# EAGLE design Grove - Infrared Emitter v1.1 (EAGLE 6.1)
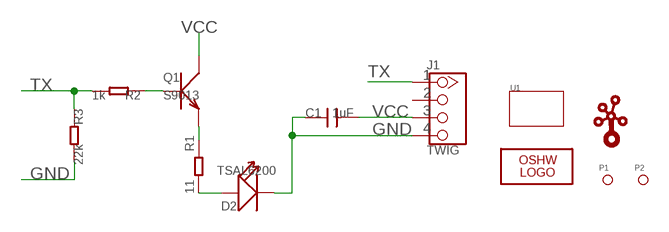
[diagram p0: schematic, sheet 1]

## Parts
C1  1uF  C-0805  [0805]
D2  TSAL6200  LED-2.54  [2P-LEADED-ROUND-2.54-R3.0]
J1  TWIG  TWIG-2.0-LEADED-2.0  [4P-LEADED-2.0]
LOGO1  LOGO-OSHW-FILLX0150-NT  [OSHW_FILLX150_NOTEXT]
P1  PAD-MARK  [ROUND-MARK-1.0]
P2  PAD-MARK  [ROUND-MARK-1.0]
Q1  S9013  TRANSISTOR-NPN-SOT23''  [SOT23]
R1  11  R-0805  [0805]
R2  1k  R-0603  [0603]
R3  22k  R-0603  [0603]
U1  TWIG-1U  [1U-DIM-W/-DRILL]
U$1  LOGO-TWIGTWIGLOGO_SMALL  [TWIGLOGO_SMALL]

## Nets
GND: C1.1 D2.- J1.4 R3.2
N$1: Q1.1(B) R2.1
N$2: Q1.2(E) R1.1
N$3: D2.+ R1.2
TX: J1.1 R2.2 R3.1
VCC: C1.2 J1.3 Q1.3(C)
Unconnected: J1.2

## Library data of the parts
C1 = Discrete:C*: Ceramic Capacitors
D2 = Discrete:LED*
J1 = Connector:TWIG-2.0-LEADED
LOGO1 = Logo:LOGO-OSHW-FILL
P1 P2 = Discrete:PAD-MARK
Q1 = Discrete:TRANSISTOR-NPN*: NPN audion
R1-R3 = Discrete:R*
U1 = Module:TWIG
U$1 = Logo:LOGO-TWIG

## Board
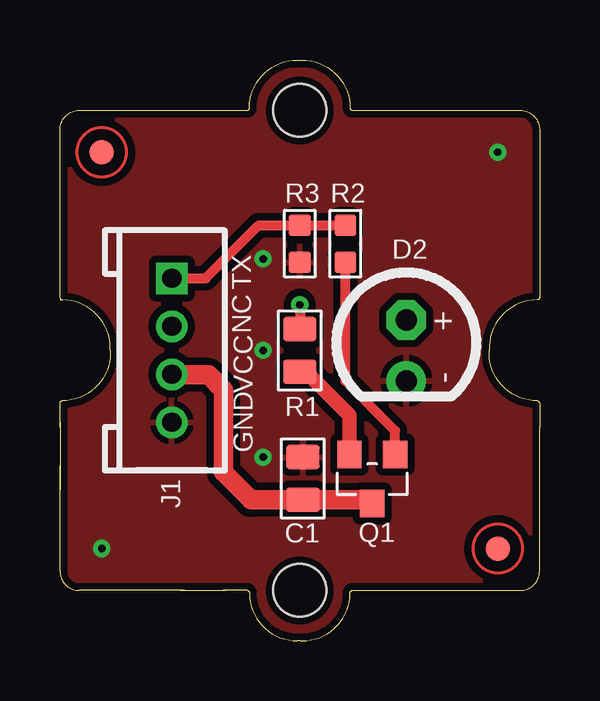
[diagram p1: board, top side]
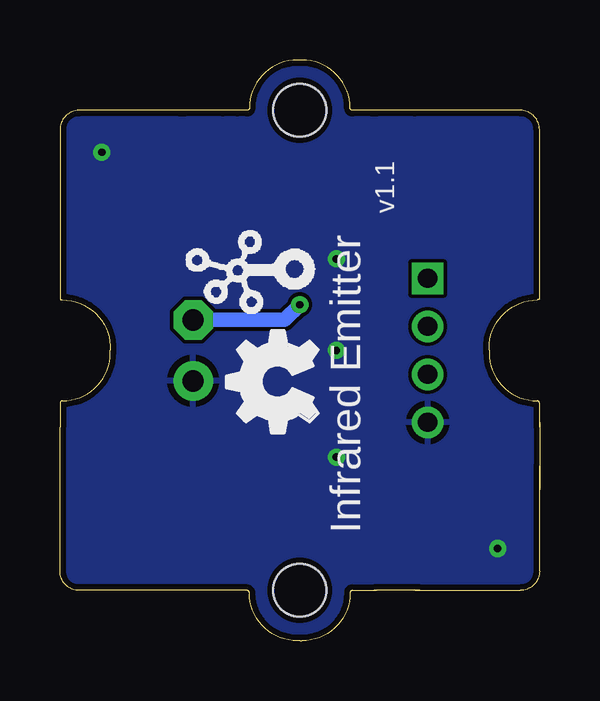
[diagram p2: board, bottom side, seen from below]

Size 20 x 24.2 mm. Coordinates in mm from the lower left corner, seen from the top.
Copper layers (1*16): Top 0.035mm / dielectric 1.5mm / Bottom 0.035mm
Design rules: minimum track width 6mil, minimum drill 12mil, track to track 6mil, track to pad 6mil, pad to pad 6mil, via to via 6mil, smd to smd 6mil, copper to edge 10mil, drill to drill 10mil, minimum pad ring 10mil, minimum via ring 8mil, stop-mask expansion 2mil, vias tented up to drill 100mil, thermal gap 10mil

### Footprints (pad centres in the part's own frame; a part is rotated, then mirrored left to right if it is on the bottom)
0805 = smd 1.016 x 1.397: 1 -0.889,0; 2 0.889,0
2P-LEADED-ROUND-2.54-R3.0 = drill 0.889 pad 1.651 octagon: + -1.27,0 | drill 0.889 pad 1.651: - 1.27,0
4P-LEADED-2.0 = drill 0.8 pad 1.27 square: 1 -3,0 | drill 0.8 pad 1.27: 2 -1,0; 3 1,0; 4 3,0
ROUND-MARK-1.0 = smd 1.016 x 1.016: P$1 0,0
SOT23 = smd 1.016 x 1.143: 1 -0.95,-1.016; 2 0.95,-1.016; 3 0,1.016
0603 = smd 0.889 x 0.889: 1 -0.762,0; 2 0.762,0
1U-DIM-W/-DRILL = hole 2.2: 0,-10; 0,10

### Placement (x,y rotation side)
C1  10.13,6.77 270 top
D2  14.44,12.1 270 top
J1  4.67,12.1 270 top
LOGO1  9.24,8.67 90 bottom
P1  1.74,20.35 0 top
P2  18.25,3.84 0 top
Q1  13.02,6.74 180 top
R1  10,12.1 90 top
R2  11.91,16.54 90 top
R3  10,16.54 270 top
U1  10,12.1 0 top
U$1  9.24,13.24 90 bottom

### Tracks (layer width: path | path; a pad name or v marks a point on that pad's centre or on a via)
GND  (via drill 0.3 pad 0.64)
  other vias: 1.74,3.84 18.25,20.35 8.48,15.91 8.48,7.66 8.48,12.1
  pour Top (isolate 0.305): -0.16,0.03 20.16,0.03 20.16,24.16 -0.16,24.16
  pour Bottom: -0.16,0.03 20.16,0.03 20.16,24.16 -0.16,24.16
N$1
  Top 0.406: Q1.1 13.97,8.76 11.91,10.83 R2.1
N$2
  Top 0.61: Q1.2 12.07,9.39 10.25,11.21 R1.1
N$3  (via drill 0.3 pad 0.64)
  Top 0.406: v10,14 R1.2
  Bottom 0.61: D2.+ 10.63,13.37 v10,14
TX
  Top 0.406: J1.1 6.08,15.1 8.29,17.31 R3.1 R2.2
VCC
  Top 0.813: Q1.3 12.87,5.88 C1.2 7.97,5.88 6.82,7.02 6.82,10.45 6.19,11.08 4.68,11.08 J1.3

### Text on the board
tPlace: TX | NC | VCC | GND
bPlace: v1.1 | Infrared Emitter